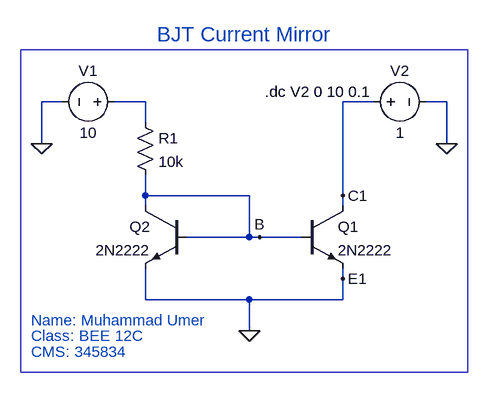
[diagram p0: schematic mirror_with_rout_calc.asc]
mirror_with_rout_calc.asc, the LTspice schematic file:
Version 4
SHEET 1 880 680
WIRE -96 -48 -128 -48
WIRE 32 -48 -16 -48
WIRE 384 -48 336 -48
WIRE 496 -48 464 -48
WIRE 32 -16 32 -48
WIRE -128 16 -128 -48
WIRE 496 16 496 -48
WIRE 32 96 32 64
WIRE 192 96 32 96
WIRE 336 96 336 -48
WIRE 32 112 32 96
WIRE 336 112 336 96
WIRE 192 160 192 96
WIRE 192 160 96 160
WIRE 208 160 192 160
WIRE 272 160 208 160
WIRE 336 224 336 208
WIRE 32 256 32 208
WIRE 192 256 32 256
WIRE 336 256 336 224
WIRE 336 256 192 256
WIRE 192 304 192 256
FLAG 192 304 0
FLAG -128 16 0
FLAG 496 16 0
FLAG 208 160 B
FLAG 336 96 C1
FLAG 336 224 E1
SYMBOL npn 272 112 R0
SYMATTR InstName Q1
SYMATTR Value 2N2222
SYMBOL npn 96 112 M0
SYMATTR InstName Q2
SYMATTR Value 2N2222
SYMBOL res 16 -32 R0
SYMATTR InstName R1
SYMATTR Value 10k
SYMBOL voltage 0 -48 R90
WINDOW 0 -32 56 VBottom 2
WINDOW 3 32 56 VTop 2
WINDOW 123 0 0 Left 0
WINDOW 39 0 0 Left 0
SYMATTR InstName V1
SYMATTR Value 10
SYMBOL voltage 368 -48 M90
WINDOW 0 -32 56 VBottom 2
WINDOW 3 32 56 VTop 2
WINDOW 123 0 0 Left 0
WINDOW 39 0 0 Left 0
SYMATTR InstName V2
SYMATTR Value 1
TEXT 216 -64 Left 2 !.dc V2 0 10 0.1
TEXT 184 -152 Center 3 ;BJT Current Mirror
TEXT -144 288 Left 2 ;Name: Muhammad Umer
TEXT -144 312 Left 2 ;Class: BEE 12C
TEXT -144 336 Left 2 ;CMS: 345834
RECTANGLE Normal -160 368 528 -128

The netlist it stands for:
* mirror_with_rout_calc.asc
Q1 C1 B 0 0 2N2222
Q2 B B 0 0 2N2222
R1 N001 B 10k
V1 N001 0 10
V2 C1 0 1
.model NPN NPN
.model PNP PNP
.lib standard.bjt
.dc V2 0 10 0.1
* BJT Current Mirror
* Name: Muhammad Umer
* Class: BEE 12C
* CMS: 345834
.backanno
.end